# Altium project BLDC_DRIVER.PrjPcb
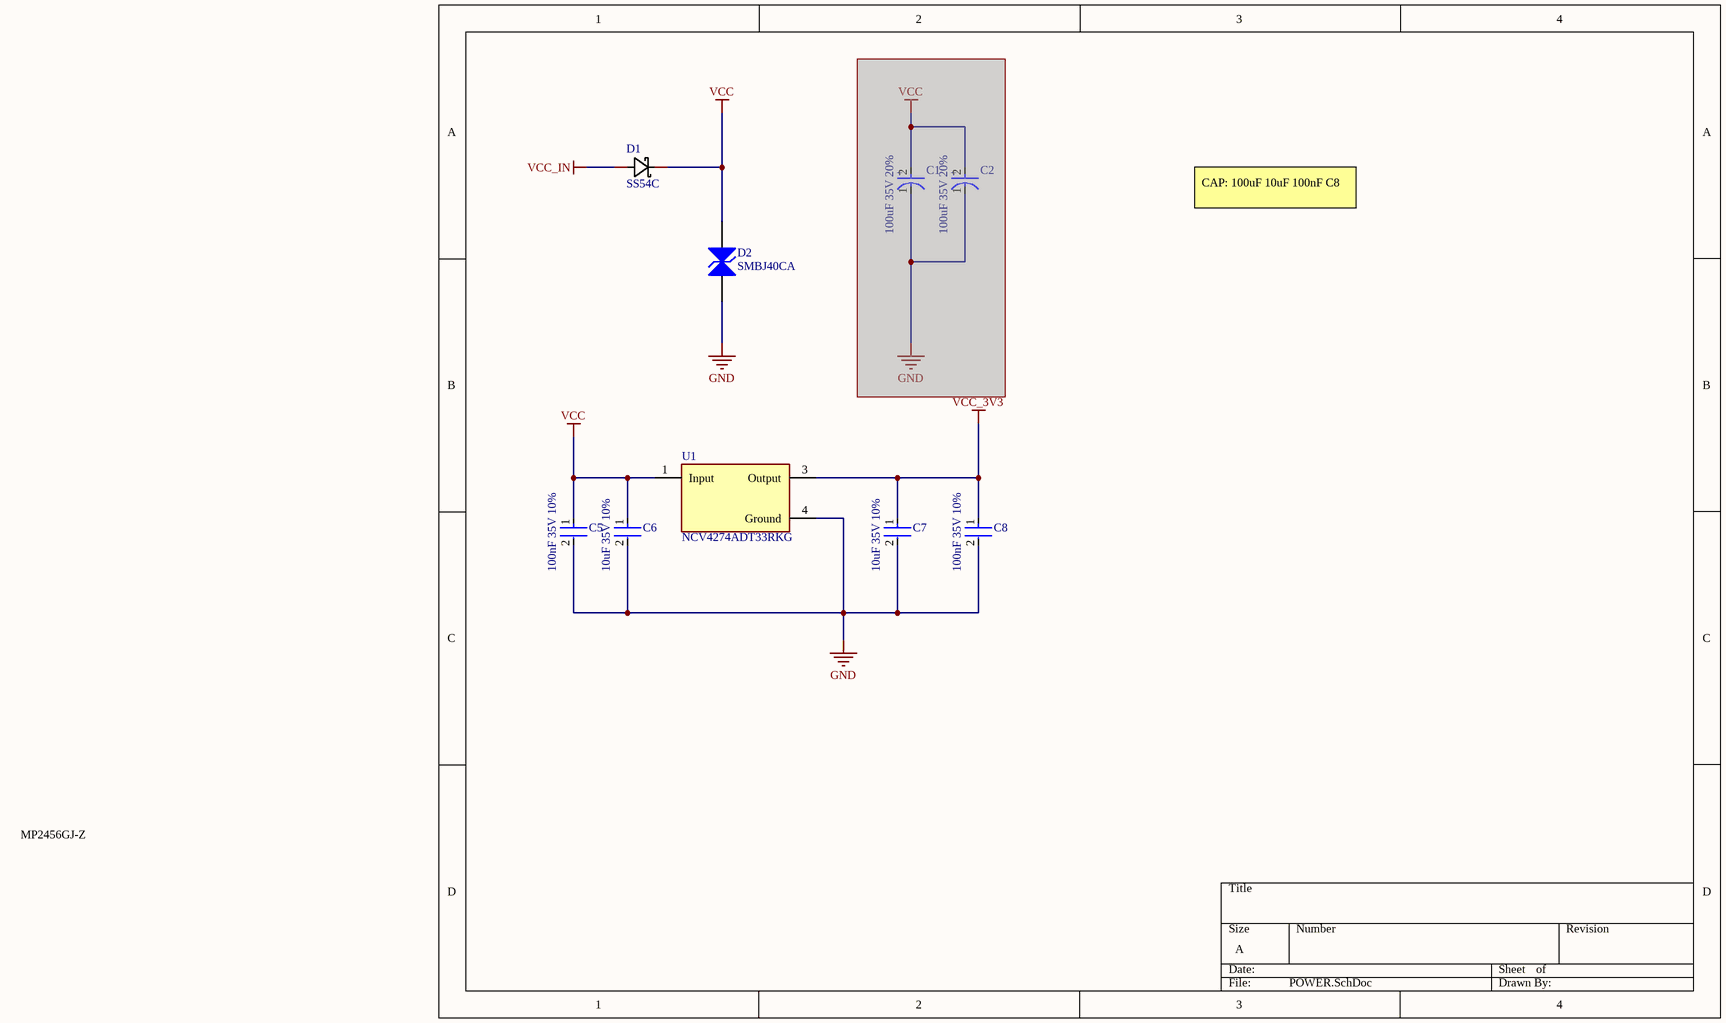
[diagram p0: POWER.SchDoc]
5 sheets, 66 parts. Net scope: global (net labels, ports and power ports of the same name join across sheets).
Board file: PCB.PcbDoc
Sheets:
  POWER.SchDoc
  MCU.SchDoc
  DRIVE.SchDoc
  SENSOR.SchDoc
  PORT.SchDoc

## Sheet POWER.SchDoc
size A; SheetNumber: 1; SheetTotal: 5; SPICEModelCachePBXSBNCE: <root> / <DocumentId>PBXSBNCE</DocumentId> / <CacheFrame Number="0"> / <Model Name="gmk105bj104_v-f" Kind="CKT"> / <Text>* GMK105BJ104_V-F     SPICE MODEL  ( General Type ) / *-------------------------------------------------------------------------------------------------------- / * Model Generated by TAIYO YUDEN Corporation (http://www.ty-top.com) / * Version 1.0 / * TAIYO YUDEN Control No. 170508_061226 / * Copyright(c) 2012 TAIYO YUDEN CO.,LTD. All Rights Reserved. / *-------------------------------------------------------------------------------------------------------- / * / * Products Name : Multilayer Ceramic Capacitors / * / * Characteristics : / *     Capacitance : 0.1 uF , Rated Voltage : 35V , TCC : B / X5R / *     Case Size : 1.0 x 0.5 / 0.039 x 0.02 [mm/inch] , Thickness : 0.5 / 0.02 [mm/inch] / *     (Conditions: Temperature = 25 degC , DC Bias Current/Voltage = 0A / 0V) / * / * Frequency Range : 40Hz - 3GHz / * / * External Node Assignments : / * / *  1  o---| |---o  2 / * / *-------------------------------------------------------------------------------------------------------- / .SubCkt GMK105BJ104_V-F 1 2 / **************************** / C0 1 110 0.070351u / Cm 1 101 0.016111u / C1 101 102 0.069296u / Rc1 101 102 16.146k / C2 102 103 0.030776u / Rc2 102 103 344.14 / C3 103 110 0.021195u / Rc3 103 110 5.1627 / C2m 1 301 0.020847u / C21 301 302 0.28927u / Rc21 301 302 15.286k / C22 302 303 0.26628u / Rc22 302 303 12.239k / C23 303 304 0.21132u / Rc23 303 304 15.145k / C24 304 305 0.078855u / Rc24 304 305 2.6688k / C25 305 306 0.20986u / Rc25 305 306 330.59 / C26 306 307 0.078155u / Rc26 306 307 723.11 / C27 307 308 0.029921u / Rc27 307 308 64.708 / C28 308 309 0.019548u / Rc28 308 309 24.402 / C29 309 110 1666p / Rc29 309 110 0.83666 / Rp0 1 110 5G / L0 110 120 0.25789n / Lm 120 130 0.093457n / L1 120 121 1.1632p / RL1 121 130 0.63209 / L2 120 122 2.3124p / RL2 122 130 1.1301 / L3 120 123 6.01p / RL3 123 130 4.6768 / CR 120 124 0.022616u / LR 124 125 0.050216n / RR 125 130 0.12272 / CL 130 140 1.7584p / LL 130 140 0.19044n / RL 130 140 98.661 / Rs 140 2 25.54m / **************************** / .ends GMK105BJ104_V-F</Text> / </Model> / <Model Name="gmk316ab7106_l-tr" Kind="CKT"> / <Text>* GMK316AB7106_L-TR     SPICE MODEL  ( General Type ) / *-------------------------------------------------------------------------------------------------------- / * Model Generated by TAIYO YUDEN Corporation (http://www.ty-top.com) / * Version 1.0 / * TAIYO YUDEN Control No. 170508_150223 / * Copyright(c) 2015 TAIYO YUDEN CO.,LTD. All Rights Reserved. / *-------------------------------------------------------------------------------------------------------- / * / * Products Name : Multilayer Ceramic Capacitors / * / * Characteristics : / *     Capacitance : 10 uF , Rated Voltage : 35V , TCC : X7R / *     Case Size : 3.2 x 1.6 / 0.126 x 0.063 [mm/inch] , Thickness : 1.6 / 0.063 [mm/inch] / *     (Conditions: Temperature = 25 degC , DC Bias Current/Voltage = 0A / 0V) / * / * Frequency Range : 40Hz - 3GHz / * / * External Node Assignments : / * / *  1  o---| |---o  2 / * / *-------------------------------------------------------------------------------------------------------- / .SubCkt GMK316AB7106_L-TR 1 2 / **************************** / C0 1 110 8.3324u / Cm 1 101 1.7802u / C1 101 102 3.8737u / Rc1 101 102 1.0428k / C2 102 103 2.6786u / Rc2 102 103 137.64 / C3 103 110 3.2592u / Rc3 103 110 0.72408 / C2m 1 301 1.3977u / C21 301 302 15.657u / Rc21 301 302 626.86 / C22 302 303 14.784u / Rc22 302 303 557.81 / C23 303 304 12.901u / Rc23 303 304 562.75 / C24 304 305 4.4911u / Rc24 304 305 239.54 / C25 305 306 2.8869u / Rc25 305 306 59.913 / C26 306 307 2.0034u / Rc26 306 307 27.629 / C27 307 308 2.0039u / Rc27 307 308 11.805 / C28 308 309 0.76536u / Rc28 308 309 18.018 / C29 309 110 0.087712u / Rc29 309 110 0.70541 / Rp0 1 110 10Meg / L0 110 120 0.29453n / Lm 120 130 0.27934n / L1 120 121 0.13982n / RL1 121 130 0.1458 / L2 120 122 0.50993n / RL2 122 130 0.17601 / L3 120 123 1.9812n / RL3 123 130 0.20956 / CR 120 124 1.0165u / LR 124 125 0.77549n / RR 125 130 30.723m / CL 130 140 1.2238p / LL 130 140 0.29705n / RL 130 140 42.338 / Rs 140 2 3.9735m / **************************** / .ends GMK316AB7106_L-TR</Text> / </Model> / </CacheFrame> / </root>

### Parts
C1  100uF 35V 20%  [FP-FTD-MFG]  (masked out: inside a compile mask, not in the netlist)
C2  100uF 35V 20%  [FP-FTD-MFG]  (masked out: inside a compile mask, not in the netlist)
C5  100nF 35V 10%  [FP-0402-L_1_0_0_05-W_0_5-IPC_A]
C6  10uF 35V 10%  [FP-1206-L_3_2_0_2-W_1_6_0-MFG]
C7  10uF 35V 10%  [FP-1206-L_3_2_0_2-W_1_6_0-MFG]
C8  100nF 35V 10%  [FP-0402-L_1_0_0_05-W_0_5-IPC_A]
D1  SS54C  [SMC_L6.9-W5.9-LS7.9-RD]
D2  SMBJ40CA  [FAIR-DO-214AA-A-2_V]
U1  NCV4274ADT33RKG  [FP-369C-MFG]

### Nets
GND: C5.2 C6.2 C7.2 C8.2 D2.2(A) U1.4(Ground)
VCC: C5.1 C6.1 D1.1(C) D2.1(A) U1.1(Input)  [project net VM11]
VCC_3V3: C7.1 C8.1 U1.3(Output)
VCC_IN: D1.2(A)

### Notes on the sheet
- CAP: 100uF 10uF 100nF C8
- MP2456GJ-Z
- (in symbol CMP-05427-000027-1) +

### Library data of the parts
C1 C2 = CMP-05427-000027-1: CAP ALUM 100UF 20% 35V SMD; Ripple Current: 300mA; Polarity: Polar; Life (Hours): 2000Hour; Lead Diameter: 0.65mm; ESR (Equivalent Series Resistance): 260mR; Leakage Current: 35uA; REACH SVHC: No SVHC; Series: FT; Min Operating Temperature: -55°C; Diameter: 6.3mm; Max Operating Temperature: 105°C; Number of Pins: 2; Package Quantity: 1000; Length: 5.8mm; Lead Pitch: 1.8mm; Voltage: 35V; Construction: Cylindrical; Capacitance: 100uF; Height: 5.8mm; Tolerance: 20%; RoHS Compliant: Yes; Packaging: Tape and Reel; Ripple Current (AC): 300mA; Height - Seated (Max): 0.24inch; Voltage Rating: 35V; Radiation Hardening: No; Contact Plating: Tin; Termination: SMD/SMT; Voltage Rating (DC): 35V; Case/Package: Radial; Mount: Surface Mount
C5 C8 = CMP-2000-06323-3: Dielectric: X5R; Voltage: 35V; Voltage Rating: 35V; Halogen Free: Halogen Free; Mount: Surface Mount; Max Operating Temperature: 85°C; Width: 0.02inch; Tolerance: 10%; Min Operating Temperature: -55°C; Length: 1mm; REACH SVHC: No SVHC; Voltage Rating (DC): 35V; Resistor Type: Ceramic; Radiation Hardening: No; Series: M; Termination: SMD/SMT; RoHS Compliant: Yes; Case/Package: 0402; Height: 0.5mm; Packaging: Tape and Reel; Construction: Flat; Capacitance: 100nF; Case Code (Metric): 1005; Case Code (Imperial): 0402; Depth: 0.5mm; Number of Pins: 2; Package Quantity: 1; Thickness: 0.022inch
C6 C7 = CMP-2000-06324-3: None; Dielectric: X7R; Thickness: 0.071inch; Mount: Surface Mount; Case Code (Imperial): 1206; Voltage Rating (DC): 35V; RoHS Compliant: Yes; Voltage Rating: 35V; Capacitance: 10uF; Case Code (Metric): 3216; Tolerance: 10%; Height: 1.6mm; Packaging: Tape and Reel; Resistor Type: Ceramic; REACH SVHC: No SVHC; Max Operating Temperature: 125°C; Termination: SMD/SMT; Package Quantity: 2000; Width: 1.6mm; Case/Package: 1206; Length: 0.126inch; Series: M; Min Operating Temperature: -55°C
D1 = SS54C_C880739: 二极管配置:-;直流反向耐压(Vr):40V;平均整流电流(Io):5A;正向压降(Vf):550mV@5A;反向电流(Ir):500A@40V;; Manufacturer: Slkor(萨科微); Add into BOM: yes; Reverse Voltage (Vr): 40V; Average Rectified Current (Io): 5A; Symbol: SS54C_C880739; Device: SS54C_C880739; LCSC Part Name: 40V 5A 550mV@5A; Supplier Part: C880739; Manufacturer Part: SS54C; Supplier Footprint: SMC(DO-214AB); JLCPCB Part Class: 扩展库; Datasheet: https://atta.szlcsc.com/upload/public/pdf/source/20201013/C880739_D47B31F19BD092A88A6CE51787FFA2A3.pdf; Supplier: LCSC; Convert to PCB: yes; Diode Configuration: -; Forward Voltage (Vf@If): 550mV@5A; Reverse Leakage Current (Ir): 500A@40V
D2 = CMP-2000-07097-1: Transient Voltage Suppressor, 600 W, 40 V, -55 to 150 degC, 2-Pin SMD, RoHS, Tape and Reel; Manufacturer: Fairchild Semiconductor; Breakdown Voltage-Max: 49.1V; Power Dissipation: 600W; Directional: Bi-Directional; Clamping Voltage-Max: 64.5V; Breakdown Voltage-Min: 44.4V; Datasheet URL: https://www.fairchildsemi.com/datasheets/SM/SMBJ40CA.pdf; Package Description: 2-Pin Surface Mount Device, Body 4.4 x 3.625 mm; Package Reference: DO-214AA; Manufacturer URL: https://www.fairchildsemi.com/; Mounting Technology: SurfaceMount; Datasheet Version: Rev. 1.1.1, 11/2014
U1 = CMP-07128-000011-1: IC REG LINEAR 3.3V 400MA DPAK; Manufacturer: ON SEMICONDUCTOR; Dropout Voltage: 1.27V; Automotive Grade: Grade 0; Number Of Outputs: 1; Max Supply Voltage: +45V; Accuracy Percentage: 2%; Standoff Height: 0mm; Max Junction Temp: +150°C; Min Supply Voltage: -42V; Output Type: Fixed; Nominal Supply Current: 145-30000uA; Digikey Description: IC REG LINEAR 3.3V 400MA DPAK; Manufacturer Part Number: NCV4274ADT33RKG; ComponentLink2Description: Datasheet; Lead Free: Yes; Output Current: 400mA; Temperature Range Low: -40°C; Temperature: -40°C to +150°C; Device Class L2: Power Management ICs; Category: IC; Device Class L1: Integrated Circuits (ICs); Octopart: https://octopart.com/ncv4274adt33rkg-on+semiconductor-10550992; Footprint Url: https://www.onsemi.com/pub/Collateral/369C.PDF; Automotive: Yes; Package: 369C; Mouser Description: IC REG LINEAR 3.3V 400MA DPAK-3; Device Class L3: Voltage Regulators - Linear; RoHS: TRUE; Height: 2.51mm; Output Voltage: 3.3V; Temperature Range High: +150°C; ComponentLink2URL: https://www.onsemi.com/pub/Collateral/NCV4274-D.PDF

## Sheet MCU.SchDoc
size A; SheetNumber: 2; SheetTotal: 5; SPICEModelCacheIKGZLCJW: <root> / <DocumentId>IKGZLCJW</DocumentId> / <CacheFrame Number="0"> / <Model Name="gmk105bj104_v-f" Kind="CKT"> / <Text>* GMK105BJ104_V-F     SPICE MODEL  ( General Type ) / *-------------------------------------------------------------------------------------------------------- / * Model Generated by TAIYO YUDEN Corporation (http://www.ty-top.com) / * Version 1.0 / * TAIYO YUDEN Control No. 170508_061226 / * Copyright(c) 2012 TAIYO YUDEN CO.,LTD. All Rights Reserved. / *-------------------------------------------------------------------------------------------------------- / * / * Products Name : Multilayer Ceramic Capacitors / * / * Characteristics : / *     Capacitance : 0.1 uF , Rated Voltage : 35V , TCC : B / X5R / *     Case Size : 1.0 x 0.5 / 0.039 x 0.02 [mm/inch] , Thickness : 0.5 / 0.02 [mm/inch] / *     (Conditions: Temperature = 25 degC , DC Bias Current/Voltage = 0A / 0V) / * / * Frequency Range : 40Hz - 3GHz / * / * External Node Assignments : / * / *  1  o---| |---o  2 / * / *-------------------------------------------------------------------------------------------------------- / .SubCkt GMK105BJ104_V-F 1 2 / **************************** / C0 1 110 0.070351u / Cm 1 101 0.016111u / C1 101 102 0.069296u / Rc1 101 102 16.146k / C2 102 103 0.030776u / Rc2 102 103 344.14 / C3 103 110 0.021195u / Rc3 103 110 5.1627 / C2m 1 301 0.020847u / C21 301 302 0.28927u / Rc21 301 302 15.286k / C22 302 303 0.26628u / Rc22 302 303 12.239k / C23 303 304 0.21132u / Rc23 303 304 15.145k / C24 304 305 0.078855u / Rc24 304 305 2.6688k / C25 305 306 0.20986u / Rc25 305 306 330.59 / C26 306 307 0.078155u / Rc26 306 307 723.11 / C27 307 308 0.029921u / Rc27 307 308 64.708 / C28 308 309 0.019548u / Rc28 308 309 24.402 / C29 309 110 1666p / Rc29 309 110 0.83666 / Rp0 1 110 5G / L0 110 120 0.25789n / Lm 120 130 0.093457n / L1 120 121 1.1632p / RL1 121 130 0.63209 / L2 120 122 2.3124p / RL2 122 130 1.1301 / L3 120 123 6.01p / RL3 123 130 4.6768 / CR 120 124 0.022616u / LR 124 125 0.050216n / RR 125 130 0.12272 / CL 130 140 1.7584p / LL 130 140 0.19044n / RL 130 140 98.661 / Rs 140 2 25.54m / **************************** / .ends GMK105BJ104_V-F</Text> / </Model> / </CacheFrame> / </root>
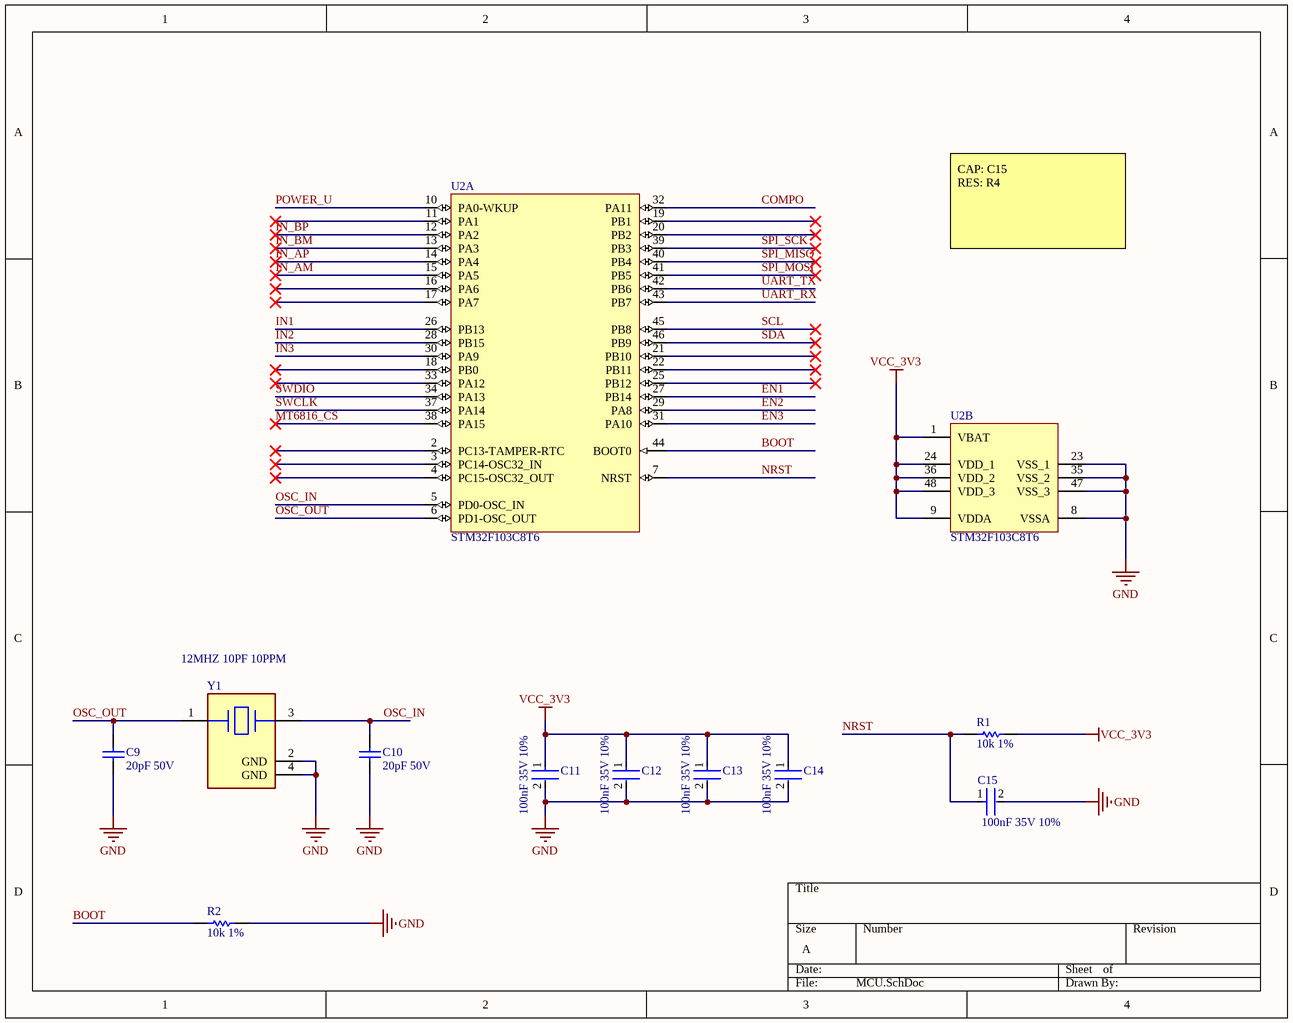
[diagram p1: MCU.SchDoc]

### Parts
(Parts that share a designator on the sheet are numbered #1, #2 ... from top to bottom, then left to right.)
C9  20pF 50V  [CAPC1608X90X30LL10T20]
C10  20pF 50V  [CAPC1608X90X30LL10T20]
C11  100nF 35V 10%  [FP-0402-L_1_0_0_05-W_0_5-IPC_A]
C12  100nF 35V 10%  [FP-0402-L_1_0_0_05-W_0_5-IPC_A]
C13  100nF 35V 10%  [FP-0402-L_1_0_0_05-W_0_5-IPC_A]
C14  100nF 35V 10%  [FP-0402-L_1_0_0_05-W_0_5-IPC_A]
C15  100nF 35V 10%  [FP-0402-L_1_0_0_05-W_0_5-IPC_A]
R1  10k 1%  [RESC2013X70X40ML20T20]
R2  10k 1%  [RESC2013X70X40ML20T20]
U2#1  STM32F103C8T6  [STM-LQFP48_L]  (parts A,B of 2)
Y1  12MHZ 10PF 10PPM  [FP-ABM3B-MFG]

### Nets
GND: C9.1 C10.1 C11.2 C12.2 C13.2 C14.2 C15.2 R2.2 U2#1.8(VSSA) U2#1.23(VSS_1) U2#1.35(VSS_2) U2#1.47(VSS_3) Y1.2(GND) Y1.4(GND)
VCC_3V3: C11.1 C12.1 C13.1 C14.1 R1.2 U2#1.1(VBAT) U2#1.9(VDDA) U2#1.24(VDD_1) U2#1.36(VDD_2) U2#1.48(VDD_3)
BOOT: R2.1 U2#1.44(BOOT0)
COMPO: U2#1.32(PA11)
EN1: U2#1.27(PB14)
EN2: U2#1.29(PA8)
EN3: U2#1.31(PA10)
IN1: U2#1.26(PB13)
IN2: U2#1.28(PB15)
IN3: U2#1.30(PA9)
IN_AM: U2#1.15(PA5)
IN_AP: U2#1.14(PA4)
IN_BM: U2#1.13(PA3)
IN_BP: U2#1.12(PA2)
MT6816_CS: U2#1.38(PA15)
NRST: C15.1 R1.1 U2#1.7(NRST)
OSC_IN: C10.2 U2#1.5(PD0-OSC_IN) Y1.3
OSC_OUT: C9.2 U2#1.6(PD1-OSC_OUT) Y1.1
POWER_U: U2#1.10(PA0-WKUP)
SCL: U2#1.45(PB8)
SDA: U2#1.46(PB9)
SPI_MISO: U2#1.40(PB4)
SPI_MOSI: U2#1.41(PB5)
SPI_SCK: U2#1.39(PB3)
SWCLK: U2#1.37(PA14)
SWDIO: U2#1.34(PA13)
UART_RX: U2#1.43(PB7)
UART_TX: U2#1.42(PB6)

Not connected (* = marked no-connect by the designer): U2#1 2(PC13-TAMPER-RTC)* 3(PC14-OSC32_IN)* 4(PC15-OSC32_OUT)* 11(PA1)* 16(PA6)* 17(PA7)* 18(PB0)* 19(PB1)* 20(PB2)* 21(PB10)* 22(PB11)* 25(PB12)* 33(PA12)*

### Notes on the sheet
- CAP: C15
  RES: R4

### Library data of the parts
C9 C10 = CMP-2000-06100-1: Chip Capacitor, 20 pF, +/- 5%, 50 V, -55 to 85 degC, 0603 (1608 Metric), RoHS, Tape and Reel; Manufacturer: Samsung Electro-Mechanics; Dielectric: C0G; Tolerance (%): ±5%; Case Size/Dimension: 0603; Datasheet Version: 06/2016; Rated Voltage: 50V; Manufacturer URL: http://www.samsungsem.com/global/index.jsp; Capacitance: 20pF; Datasheet URL: http://www.samsungsem.com/kr/support/product-search/mlcc/__icsFiles/afieldfile/2016/08/18/S_CL10C200JB8NNNC.pdf; Mounting Technology: SurfaceMount; Package Description: 2-Pin Surface Mount Device, Body 1.60 x 0.80 mm; Package Reference: 0603
C11-C15 = CMP-2000-06323-3: Dielectric: X5R; Voltage: 35V; Voltage Rating: 35V; Halogen Free: Halogen Free; Mount: Surface Mount; Max Operating Temperature: 85°C; Width: 0.02inch; Tolerance: 10%; Min Operating Temperature: -55°C; Length: 1mm; REACH SVHC: No SVHC; Voltage Rating (DC): 35V; Resistor Type: Ceramic; Radiation Hardening: No; Series: M; Termination: SMD/SMT; RoHS Compliant: Yes; Case/Package: 0402; Height: 0.5mm; Packaging: Tape and Reel; Construction: Flat; Capacitance: 100nF; Case Code (Metric): 1005; Case Code (Imperial): 0402; Depth: 0.5mm; Number of Pins: 2; Package Quantity: 1; Thickness: 0.022inch
R1 R2 = CMP-2001-04376-1: Manufacturer: Panasonic; Part Number: ERJ-6ENF1002V
U2#1 = CMP-0237-00215-3: ARM Cortex-M3 32-bit MCU, 64 KB Flash, 20 KB Internal RAM, 37 I/Os, 48-pin LQFP, -40 to 85 degC, Tray; Supply Voltage(Vcc) min (V): 2; Internal RAM Size (kB): 20; FLASH Size (Prog) (kB): 64; A/D Converter: 2x12-bit (10 Channel); I/Os (High Current): 37; Operating Frequency(F) (Processor speed) (MHz): 72; Core: ARM Cortex-M3; ComponentLink3Description: Package Specification; Mounting Technology: Surface Mount; PartNumber: STM32F103C8T6; PackageReference: LQFP48; Packing: Tray; ComponentLink3URL: http://www.st.com/st-web-ui/static/active/en/resource/technical/document/datasheet/DM00058181.pdf; DatasheetVersion: Rev. 16; ComponentLink1URL: http://www.st.com/web/en/home.html; PackageVersion: Rev. 6, 06/2013; ComponentLink2URL: http://www.st.com/st-web-ui/static/active/en/resource/technical/document/datasheet/CD00161566.pdf; ComponentLink1Description: Manufacturer URL; ComponentLink2Description: Datasheet; PackageDescription: 48-Pin Low Profile Quad Flat Package, 7 x 7 mm Body, 0.5 mm Pitch
Y1 = CMP-27762-011386-1: Crystal 12MHz ±10ppm 10pF SMD-4 5mm x 3.2mm; ESR (Equivalent Series Resistance): 70R; Resistor Type: Ceramic; Width: 0.126inch; Max Operating Temperature: 60°C; Series: ABM3B; Load Capacitance: 10pF; Package Quantity: 1000; Tolerance: 10ppm; Termination: SMD/SMT; Lead Free: Lead Free; Operating Frequency: 12 MHz; Number of Pins: 4; Case/Package: CSMD; Min Operating Temperature: -10°C; Packaging: Tape and Reel; Frequency Stability: 10ppm; Frequency: 12MHz; Height: 0.043inch; Depth: 3.2mm; Series Resistance: 70R; REACH SVHC: No SVHC; Length: 5mm; Mount: Surface Mount; Frequency Tolerance: 10ppm

## Sheet DRIVE.SchDoc
size 381 x 241 mm; SheetNumber: 3; SheetTotal: 5; SPICEModelCacheKBKWLXEO: <root> / <DocumentId>KBKWLXEO</DocumentId> / <CacheFrame Number="0"> / <Model Name="gmk105bj104_v-f" Kind="CKT"> / <Text>* GMK105BJ104_V-F     SPICE MODEL  ( General Type ) / *-------------------------------------------------------------------------------------------------------- / * Model Generated by TAIYO YUDEN Corporation (http://www.ty-top.com) / * Version 1.0 / * TAIYO YUDEN Control No. 170508_061226 / * Copyright(c) 2012 TAIYO YUDEN CO.,LTD. All Rights Reserved. / *-------------------------------------------------------------------------------------------------------- / * / * Products Name : Multilayer Ceramic Capacitors / * / * Characteristics : / *     Capacitance : 0.1 uF , Rated Voltage : 35V , TCC : B / X5R / *     Case Size : 1.0 x 0.5 / 0.039 x 0.02 [mm/inch] , Thickness : 0.5 / 0.02 [mm/inch] / *     (Conditions: Temperature = 25 degC , DC Bias Current/Voltage = 0A / 0V) / * / * Frequency Range : 40Hz - 3GHz / * / * External Node Assignments : / * / *  1  o---| |---o  2 / * / *-------------------------------------------------------------------------------------------------------- / .SubCkt GMK105BJ104_V-F 1 2 / **************************** / C0 1 110 0.070351u / Cm 1 101 0.016111u / C1 101 102 0.069296u / Rc1 101 102 16.146k / C2 102 103 0.030776u / Rc2 102 103 344.14 / C3 103 110 0.021195u / Rc3 103 110 5.1627 / C2m 1 301 0.020847u / C21 301 302 0.28927u / Rc21 301 302 15.286k / C22 302 303 0.26628u / Rc22 302 303 12.239k / C23 303 304 0.21132u / Rc23 303 304 15.145k / C24 304 305 0.078855u / Rc24 304 305 2.6688k / C25 305 306 0.20986u / Rc25 305 306 330.59 / C26 306 307 0.078155u / Rc26 306 307 723.11 / C27 307 308 0.029921u / Rc27 307 308 64.708 / C28 308 309 0.019548u / Rc28 308 309 24.402 / C29 309 110 1666p / Rc29 309 110 0.83666 / Rp0 1 110 5G / L0 110 120 0.25789n / Lm 120 130 0.093457n / L1 120 121 1.1632p / RL1 121 130 0.63209 / L2 120 122 2.3124p / RL2 122 130 1.1301 / L3 120 123 6.01p / RL3 123 130 4.6768 / CR 120 124 0.022616u / LR 124 125 0.050216n / RR 125 130 0.12272 / CL 130 140 1.7584p / LL 130 140 0.19044n / RL 130 140 98.661 / Rs 140 2 25.54m / **************************** / .ends GMK105BJ104_V-F</Text> / </Model> / </CacheFrame> / </root>
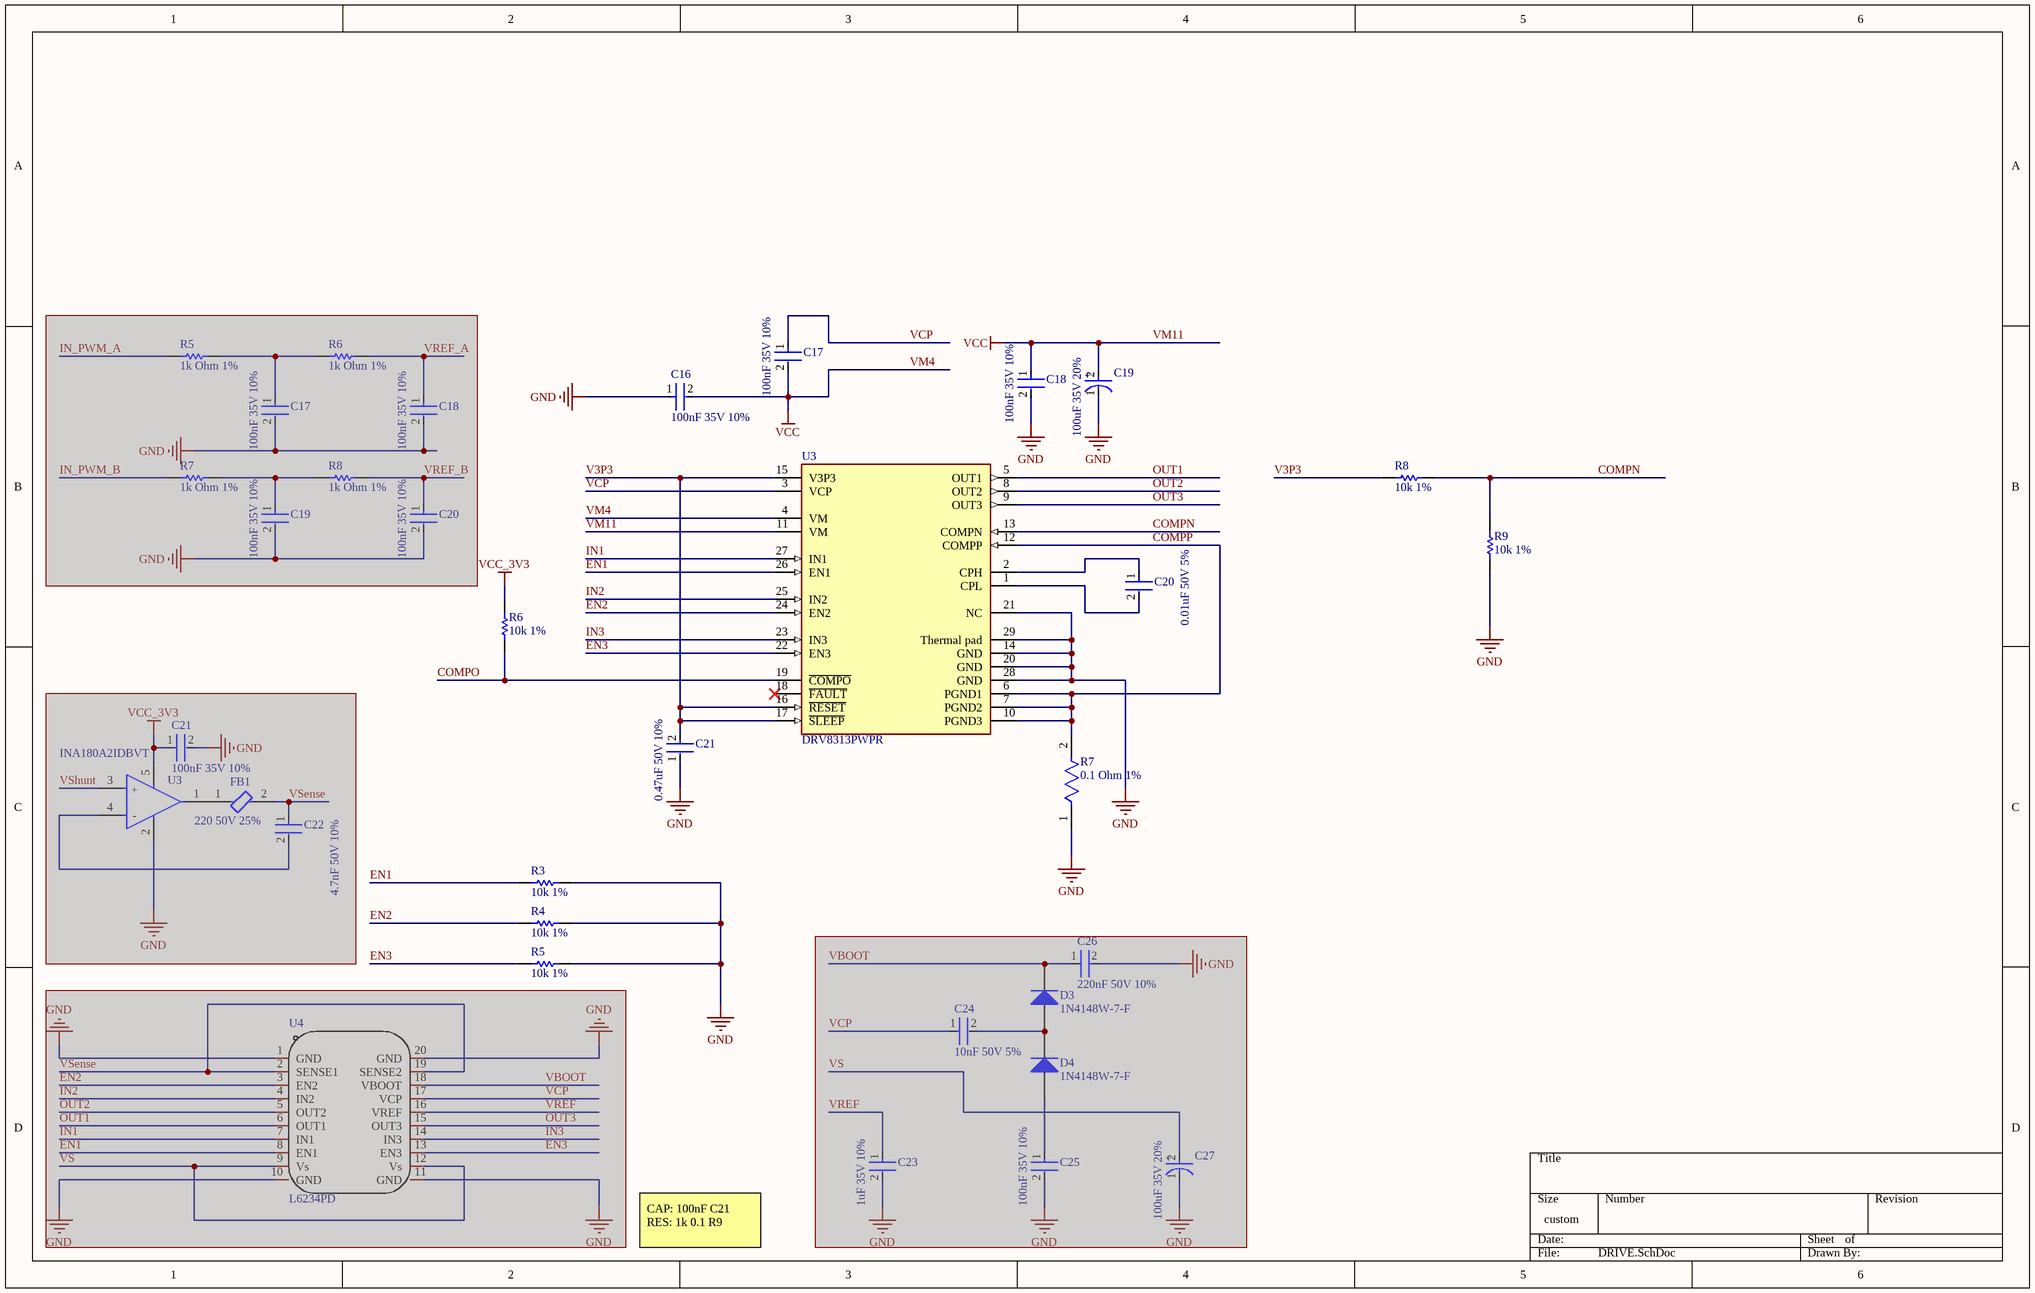
[diagram p2: DRIVE.SchDoc]

### Parts
(Parts that share a designator on the sheet are numbered #1, #2 ... from top to bottom, then left to right.)
C16  100nF 35V 10%  [FP-0402-L_1_0_0_05-W_0_5-IPC_A]
C17#1  100nF 35V 10%  [FP-0402-L_1_0_0_05-W_0_5-IPC_A]
C17#2  100nF 35V 10%  [FP-0402-L_1_0_0_05-W_0_5-IPC_A]  (masked out: inside a compile mask, not in the netlist)
C18#1  100nF 35V 10%  [FP-0402-L_1_0_0_05-W_0_5-IPC_A]
C18#2  100nF 35V 10%  [FP-0402-L_1_0_0_05-W_0_5-IPC_A]  (masked out: inside a compile mask, not in the netlist)
C19#1  100uF 35V 20%  [FP-FTD-MFG]
C19#2  100nF 35V 10%  [FP-0402-L_1_0_0_05-W_0_5-IPC_A]  (masked out: inside a compile mask, not in the netlist)
C20#1  100nF 35V 10%  [FP-0402-L_1_0_0_05-W_0_5-IPC_A]  (masked out: inside a compile mask, not in the netlist)
C20#2  0.01uF 50V 5%  [FP-C0805C-DN-MFG]
C21#1  0.47uF 50V 10%  [FP-C1608-080-0_1-IPC_A]
C21#2  100nF 35V 10%  [FP-0402-L_1_0_0_05-W_0_5-IPC_A]  (masked out: inside a compile mask, not in the netlist)
C22#1  4.7nF 50V 10%  [FP-1206-L_3_2_0_2-W_1_6_0-IPC_C]  (masked out: inside a compile mask, not in the netlist)
C23#1  1uF 35V 10%  [FP-0805-L_2_0_0_1-W_1_25-IPC_C]  (masked out: inside a compile mask, not in the netlist)
C24#1  10nF 50V 5%  [FP-GRM219-0_1-IPC_C]  (masked out: inside a compile mask, not in the netlist)
C25  100nF 35V 10%  [FP-0402-L_1_0_0_05-W_0_5-IPC_A]  (masked out: inside a compile mask, not in the netlist)
C26  220nF 50V 10%  [FP-C1608-080-0_1-IPC_C]  (masked out: inside a compile mask, not in the netlist)
C27  100uF 35V 20%  [FP-FTD-MFG]  (masked out: inside a compile mask, not in the netlist)
D3  1N4148W-7-F  [DIOD-SOD123-2_V]  (masked out: inside a compile mask, not in the netlist)
D4  1N4148W-7-F  [DIOD-SOD123-2_V]  (masked out: inside a compile mask, not in the netlist)
FB1  220 50V 25%  [FP-BLM18-0_15-t0_5-IPC_A]  (masked out: inside a compile mask, not in the netlist)
R3  10k 1%  [RESC2013X70X40ML20T20]
R4  10k 1%  [RESC2013X70X40ML20T20]
R5#1  1k Ohm 1%  [RESC2013X60X35ML10T20]  (masked out: inside a compile mask, not in the netlist)
R5#2  10k 1%  [RESC2013X70X40ML20T20]
R6#1  1k Ohm 1%  [RESC2013X60X35ML10T20]  (masked out: inside a compile mask, not in the netlist)
R6#2  10k 1%  [RESC2013X70X40ML20T20]
R7#1  1k Ohm 1%  [RESC2013X60X35ML10T20]  (masked out: inside a compile mask, not in the netlist)
R7#2  0.1 Ohm 1%  [FP-ERJ8BW-MFG]
R8#1  10k 1%  [RESC2013X70X40ML20T20]
R8#2  1k Ohm 1%  [RESC2013X60X35ML10T20]  (masked out: inside a compile mask, not in the netlist)
R9  10k 1%  [RESC2013X70X40ML20T20]
U3#1  DRV8313PWPR  [FP-PWP0028C-IPC_B]
U3#2  INA180A2IDBVT  [FP-DBV0005A-IPC_C]  (masked out: inside a compile mask, not in the netlist)
U4#1  L6234PD  [POWERSO-20_L15.9-W11.0-P1.27-LS14.2-BL-EP]  (masked out: inside a compile mask, not in the netlist)

### Nets
GND: C16.1 C18#1.2 C19#1.1(C) C21#1.1 R3.2 R4.2 R5#2.2 R7#2.1 R9.1 U3#1.14(GND) U3#1.20(GND) U3#1.21(NC) U3#1.28(GND) U3#1.29(Thermal_pad)
VCC_3V3: R6#2.2
VM11: C16.2 C17#1.2 C18#1.1 C19#1.2(A) U3#1.4(VM) U3#1.11(VM)  [also labelled VCC, VM4]
COMPN: R8#1.2 R9.2 U3#1.13(COMPN)
COMPO: R6#2.1 U3#1.19(~{COMPO})
COMPP: R7#2.2 U3#1.6(PGND1) U3#1.7(PGND2) U3#1.10(PGND3) U3#1.12(COMPP)
EN1: R3.1 U3#1.26(EN1)
EN2: R4.1 U3#1.24(EN2)
EN3: R5#2.1 U3#1.22(EN3)
IN1: U3#1.27(IN1)
IN2: U3#1.25(IN2)
IN3: U3#1.23(IN3)
OUT1: U3#1.5(OUT1)
OUT2: U3#1.8(OUT2)
OUT3: U3#1.9(OUT3)
V3P3: C21#1.2 R8#1.1 U3#1.15(V3P3) U3#1.16(~{RESET}) U3#1.17(~{SLEEP})
VCP: C17#1.1 U3#1.3(VCP)
NetC20#2_1: C20#2.1 U3#1.2(CPH)
NetC20#2_2: C20#2.2 U3#1.1(CPL)

Not connected (* = marked no-connect by the designer): U3#1 18(~{FAULT})*

### Notes on the sheet
- CAP: 100nF C21
  RES: 1k 0.1 R9
- (in symbol CMP-04895-000174-1) +; -
- (in symbol CMP-05427-000027-1) +

### Library data of the parts
C16 C17#1 C17#2 C18#1 C18#2 C19#2 C20#1 C21#2 C25 = CMP-2000-06323-3: Dielectric: X5R; Voltage: 35V; Voltage Rating: 35V; Halogen Free: Halogen Free; Mount: Surface Mount; Max Operating Temperature: 85°C; Width: 0.02inch; Tolerance: 10%; Min Operating Temperature: -55°C; Length: 1mm; REACH SVHC: No SVHC; Voltage Rating (DC): 35V; Resistor Type: Ceramic; Radiation Hardening: No; Series: M; Termination: SMD/SMT; RoHS Compliant: Yes; Case/Package: 0402; Height: 0.5mm; Packaging: Tape and Reel; Construction: Flat; Capacitance: 100nF; Case Code (Metric): 1005; Case Code (Imperial): 0402; Depth: 0.5mm; Number of Pins: 2; Package Quantity: 1; Thickness: 0.022inch
C19#1 C27 = CMP-05427-000027-1: as C1 on sheet POWER; REACH SVHC: No SVHC; Series: FT; Min Operating Temperature: -55°C; Diameter: 6.3mm; Max Operating Temperature: 105°C; Number of Pins: 2; Package Quantity: 1000; Length: 5.8mm; Lead Pitch: 1.8mm; Voltage: 35V; Construction: Cylindrical; Capacitance: 100uF; Height: 5.8mm; Tolerance: 20%; RoHS Compliant: Yes; Packaging: Tape and Reel; Ripple Current (AC): 300mA; Height - Seated (Max): 0.24inch; Voltage Rating: 35V; Radiation Hardening: No; Contact Plating: Tin; Termination: SMD/SMT; Voltage Rating (DC): 35V; Case/Package: Radial; Mount: Surface Mount
C20#2 = CMP-2007-00254-2: CAP CER 10000PF 50V X7R 0805; Manufacturer Part Number: C0805C103J5RACTU; Manufacturer: KEMET; Value: 10,000 pF; Material: Ceramic; Temperature Coefficient: 30ppm/°C; Description: C0805 10,000 pF X7R 30ppm/°C 5.00% 50 V; Tolerance: 0.05; Device Class L1: Passive Components; Temperature: -55°C to +125°C; Lead Free: Yes; ComponentLink2URL: https://content.kemet.com/datasheets/KEM_C1003_C0G_SMD.pdf; Device Class L3: Ceramic Capacitors; Temperature Characteristic: X7R; Temperature Range High: +125°C; Mouser Description: Capacitor; Ceramic; Cap 0.01uF; Tol 5%; Vol-Rtg 50 V; SMT; Case 0805; X7R; TR; ComponentLink2Description: Datasheet; Height: 0.88mm; Digikey Description: CAP CER 10000PF 50V X7R 0805; Capacitance: 10,000 pF; Temperature Range Low: -55°C; Device Class L2: Capacitors; Octopart: https://octopart.com/c0805c103j5ractu-kemet-133473; Voltage Rating: 50 V; Category: Cap; RoHS: TRUE; Automotive: No; Package: C0805C-DN; Ipc Land Pattern Name: CAPC200125X78
C21#1 = CMP-08246-003628-1: Multilayer Ceramic Capacitors 470nF ±10% 50V X7R SMD 0603; Resistor Type: Ceramic; Radiation Hardening: No; Termination: SMD/SMT; Min Operating Temperature: -55°C; RoHS Compliant: Yes; Length: 1.6mm; Package Quantity: 4000; Tolerance: 10%; Packaging: Cut Tape; Max Operating Temperature: 125°C; Series: C; Thickness: 0.037inch; Voltage Rating (DC): 50V; Mount: Surface Mount; Weight: 7.1E-05oz; Dielectric: X7R; Case/Package: 0603; Construction: Flat; Height: 0.8mm; Capacitance: 470nF; Case Code (Metric): 1608; Voltage: 50V; Dielectric Material: Ceramic; Voltage Rating: 50V; Depth: 0.8mm; Lead Free: Lead Free; REACH SVHC: No SVHC; Width: 0.031inch; Case Code (Imperial): 0603
C22#1 = CMP-04427-019159-1: General Purpose Ceramic Capacitor, 1206, 4.7nF, 10%, X7R, 15%, 50V; Dissipation Factor: 2.5%; Min Operating Temperature: -55°C; Length: 3.2mm; Mount: Surface Mount; Case Code (Metric): 3216; Depth: 1.6mm; Voltage Rating (DC): 50V; Dielectric Material: Ceramic; Termination: SMD/SMT; Radiation Hardening: No; Voltage: 50V; Capacitance: 4.7nF; Dielectric: X7R; Series: -; Max Operating Temperature: 125°C; Lead Free: Lead Free; Number of Pins: 2; Tolerance: 10%; Thickness: 0.037inch; Packaging: Tape and Reel; Package Quantity: 1; Case/Package: 1206; Contact Plating: Tin; Construction: Flat; Height: 0.94mm; Voltage Rating: 50V; RoHS Compliant: Yes; Width: 1.6mm; Case Code (Imperial): 1206
C23#1 = CMP-14477-004038-2: Multilayer Ceramic Capacitor 1 uF 35V X7R 10% SMD 0805 T/R; Contact Plating: Nickel; Voltage: 35V; Height: 1.25mm; Width: 0.049inch; Voltage Rating: 35V; Depth: 1.25mm; Capacitance: 1uF; Packaging: Tape and Reel; Radiation Hardening: No; Min Operating Temperature: -55°C; Series: M; Halogen Free: Halogen Free; Thickness: 0.053inch; Termination: SMD/SMT; Length: 2mm; Lead Free: Lead Free; Case/Package: 0805; Construction: Flat; RoHS Compliant: Yes; Tolerance: 10%; Package Quantity: 1; Max Operating Temperature: 125°C; Number of Pins: 2; Voltage Rating (DC): 35V; Case Code (Imperial): 0805; Case Code (Metric): 2012; Dielectric: X7R; Mount: Surface Mount
C24#1 = CMP-2007-00135-2: Chip Multilayer Ceramic Capacitors for General Purpose, 0805, 10000pF, C0G, 30ppm/°C, 5%, 50V; Insulation Resistance: 10GR; Max Operating Temperature: 125°C; Height: 0.85mm; Voltage: 50V; Dielectric Material: Ceramic; Voltage Rating: 50V; Dielectric: C0G; Thickness: 0.037inch; REACH SVHC: No SVHC; Lead Free: Lead Free; Depth: 1.25mm; Min Operating Temperature: -55°C; Package Quantity: 1; Packaging: Tape and Reel; Case Code (Imperial): 0805; Case/Package: 0805; Mount: Surface Mount; Width: 0.049inch; Case Code (Metric): 2012; Length: 2mm; Termination: SMD/SMT; Material: Ceramic; Tolerance: 5%; Temperature Coefficient: 30ppm/°C; Capacitance: 10nF; Number of Pins: 2; Voltage Rating (DC): 50V; Radiation Hardening: No
C26 = CMP-2000-05394-2: Multilayer Ceramic Capacitors 220nF ±10% 50V X7R SMD 0603; Construction: Flat; Case Code (Imperial): 0603; Min Operating Temperature: -55°C; Weight: 7.1E-05oz; Dielectric: X7R; Radiation Hardening: No; Length: 1.6mm; Mount: Surface Mount; Tolerance: 10%; Thickness: 0.035inch; Capacitance: 220nF; Dielectric Material: Ceramic; Voltage: 50V; Depth: 0.8mm; Voltage Rating (DC): 50V; REACH SVHC: No SVHC; RoHS Compliant: Yes; Lead Free: Lead Free; Termination: SMD/SMT; Max Operating Temperature: 125°C; Packaging: Tape and Reel; Voltage Rating: 50V; Series: C; Case/Package: 0603; Resistor Type: Ceramic; Package Quantity: 1; Number of Pins: 2; Height: 0.8mm; Case Code (Metric): 1608; Width: 0.031inch
D3 D4 = CMP-2000-04932-2: Fast Switching Diode, 100 V, 0.15 A, -65 to 150 degC, 2-Pin?SOD123, RoHS, Tape and Reel; Recovery Time: 4ns; Brand: DiodesIncorporated; Unit Weight: 0.000353oz; Max Surge Current: 2A; Peak Reverse Voltage: 100V; Ir - Reverse Current: 1uA; Vf - Forward Voltage: 1.25V; Configuration: Single; If - Forward Current: 0.15A; Product Category: Diodes-GeneralPurpose,Power,Switching; Operating Temperature Range: -65Cto+150C; Packaging: Reel; Manufacturer URL: http://www.diodes.com/; Maximum Operating Temperature: +150C; Height: 1.25mm; Minimum Operating Temperature: -65C; Product: SwitchingDiodes; Package URL: http://www.diodes.com/datasheets/ds18004.pdf; Type: SwitchingDiode; Package Reference: SOD123-2; Width: 1.7mm; Datasheet URL: http://www.farnell.com/datasheets/1915529.pdf; Datasheet Version: Rev. 24-2, 10/2013; Series: 1N4148; Factory Pack Quantity: 3000; Length: 2.85mm; RoHS: True; Manufacturer: DiodesIncorporated; Mounting Style: SMD/SMT; Package / Case: SOD-123
FB1 = CMP-0686-00596-3: Chip Ferrite Bead, 0603, 220Ω @ 100MHz, 25%, 0.04Ω, 2.5A; Impedance: 220R; DC Resistance-Max: 40mR; Number of Circuits: 1; Test Frequency: 100MHz; Material: Ferrite; Lead Free: Lead Free; Width: 0.8mm; Max Current Rating: 2.5A; Termination: SMD/SMT; Depth: 0.95mm; Packaging: Tape and Reel; Case Code (Metric): 1608; DC Current: 2.5A; Weight: 7.1E-05oz; Min Operating Temperature: -55°C; DC Resistance (DCR): 40mR; Max Operating Temperature: 125°C; Core Material: Ferrite; Max DC Current: 2.5A; Case/Package: 0603; REACH SVHC: No SVHC; Height: 0.8mm; Number of Pins: 2; Tolerance: 25%; RoHS Compliant: Yes; Radiation Hardening: No; Current Rating: 2.5A; Number of Lines: 1; Series: BLM18S; Case Code (Imperial): 0603; Length: 1.6mm; Package Quantity: 1
R3 R4 R5#2 R6#2 R8#1 R9 = CMP-2001-04376-1: as R1 on sheet MCU
R5#1 R6#1 R7#1 R8#2 = CMP-2100-03671-1: Chip Resistor, 1 KOhm, +/- 1%, 125 mW, -55 to 155 degC, 0805 (2012 Metric), RoHS, Tape and Reel; Manufacturer: Yageo; Temperature Coefficient: 100ppm/degreesC; Voltage Rating (DC): 150V; Max Power Dissipation: 125mW; Resistance: 1KOhm; Number of Pins: 2; Number of Terminations: 2; Datasheet URL: http://www.yageo.com/NewPortal/yageodocoutput?fileName=/pdf/R-Chip/PYu-RC_Group_51_RoHS_L_5.pdf; Length: 0.079inch; Package Description: 2-Pin Surface Mounted Device, Body 2 x 1.25 mm; Depth: 1.25mm; Height: 0.024inch; Military Standard: Not; Case/Package: 0805; Package Reference: 0805; RoHSCompliant: true; Lead Free: LeadFree; Packaging: TapeandReel; Package Quantity: 1; Datasheet Version: Rev. 5, 10/2016; Tolerance: 1%; Min Operating Temperature: -55degC; Voltage Rating: 150V; Composition: ThickFilm; Case Code (Imperial): 0805; Power Rating: 125mW; Width: 0.049inch; Case Code (Metric): 2012; Manufacturer URL: http://www.yageo.com/; Max Operating Temperature: 155degC; REACH SVHC: Unknown; Termination: SMD/SMT
R7#2 = CMP-2003-00785-2: RES 0.1 OHM 1% 1W 1206; Resistance: 100mR; Temperature Coefficient: 100ppm/°C; Lead Free: Lead Free; Features: Automotive AEC-Q200; Case/Package: 1206; Width: 0.063inch; Radiation Hardening: No; Power Rating: 1W; Resistance Tolerance: 1%; Resistor Type: Thick Film; Max Power Dissipation: 1W; Case Code (Metric): 3216; Package Quantity: 1; Tolerance: 1%; Number of Terminations: 2; Number of Pins: 2; Length: 3.2mm; Case Code (Imperial): 1206; Size Code: 1206; Mount: Surface Mount; Height: 0.65mm; Termination: SMD/SMT; Min Operating Temperature: -55°C; Packaging: Tape and Reel; Military Standard: Not; Series: ERJ; Depth: 1.6mm; REACH SVHC: No SVHC; Max Operating Temperature: 155°C; Contact Plating: Tin; Technology: THICK FILM; RoHS Compliant: Yes; Construction: Rectangular
U3#1 = CMP-04915-000025-1: IC MOTOR DRIVER 8V-60V 28HTSSOP; Min Supply Voltage: 8V; Max Supply Voltage: 60V; Interface: Parallel; Output Current: 1.75A; Number of Outputs: 1; Logic Function: AND GATE; Package Quantity: 2000; Number of Pins: 28; Case/Package: HTSSOP; Min Operating Temperature: -40°C; Mount: Surface Mount; Series: -; Packaging: Tape and Reel; Max Operating Temperature: 125°C; Lead Free: Lead Free
U3#2 = CMP-04895-000174-1: IC CURR SENSE 1 CIRCUIT SOT23-5; Number of Circuits: 1; Input Offset Voltage (Vos): 100uV; Operating Supply Current: 260uA; -3db Bandwidth: 350kHz; Slew Rate: 2V/µs; Input Bias Current: 100nA; Min Operating Temperature: -40°C; Mount: Surface Mount; RoHS Compliant: Yes; Packaging: Tape and Reel; Case/Package: SOT-23-5; Max Operating Temperature: 125°C
U4#1 = L6234PD: Manufacturer: ST(意法半导体); Add into BOM: yes; Symbol: L6234PD; Device: L6234PD; LCSC Part Name: L6234PD; Supplier Part: C1523896; Manufacturer Part: L6234PD; Supplier Footprint: PowerSO-20; JLCPCB Part Class: 扩展库; Datasheet: https://atta.szlcsc.com/upload/public/pdf/source/20210630/7ACC9A8B265CB70C9962226C06E1BA42.pdf; Supplier: LCSC; Convert to PCB: yes

## Sheet SENSOR.SchDoc
size A4; SheetNumber: 4; SheetTotal: 5; SPICEModelCacheALUSSDSW: <root> / <DocumentId>ALUSSDSW</DocumentId> / <CacheFrame Number="0"> / <Model Name="gmk105bj104_v-f" Kind="CKT"> / <Text>* GMK105BJ104_V-F     SPICE MODEL  ( General Type ) / *-------------------------------------------------------------------------------------------------------- / * Model Generated by TAIYO YUDEN Corporation (http://www.ty-top.com) / * Version 1.0 / * TAIYO YUDEN Control No. 170508_061226 / * Copyright(c) 2012 TAIYO YUDEN CO.,LTD. All Rights Reserved. / *-------------------------------------------------------------------------------------------------------- / * / * Products Name : Multilayer Ceramic Capacitors / * / * Characteristics : / *     Capacitance : 0.1 uF , Rated Voltage : 35V , TCC : B / X5R / *     Case Size : 1.0 x 0.5 / 0.039 x 0.02 [mm/inch] , Thickness : 0.5 / 0.02 [mm/inch] / *     (Conditions: Temperature = 25 degC , DC Bias Current/Voltage = 0A / 0V) / * / * Frequency Range : 40Hz - 3GHz / * / * External Node Assignments : / * / *  1  o---| |---o  2 / * / *-------------------------------------------------------------------------------------------------------- / .SubCkt GMK105BJ104_V-F 1 2 / **************************** / C0 1 110 0.070351u / Cm 1 101 0.016111u / C1 101 102 0.069296u / Rc1 101 102 16.146k / C2 102 103 0.030776u / Rc2 102 103 344.14 / C3 103 110 0.021195u / Rc3 103 110 5.1627 / C2m 1 301 0.020847u / C21 301 302 0.28927u / Rc21 301 302 15.286k / C22 302 303 0.26628u / Rc22 302 303 12.239k / C23 303 304 0.21132u / Rc23 303 304 15.145k / C24 304 305 0.078855u / Rc24 304 305 2.6688k / C25 305 306 0.20986u / Rc25 305 306 330.59 / C26 306 307 0.078155u / Rc26 306 307 723.11 / C27 307 308 0.029921u / Rc27 307 308 64.708 / C28 308 309 0.019548u / Rc28 308 309 24.402 / C29 309 110 1666p / Rc29 309 110 0.83666 / Rp0 1 110 5G / L0 110 120 0.25789n / Lm 120 130 0.093457n / L1 120 121 1.1632p / RL1 121 130 0.63209 / L2 120 122 2.3124p / RL2 122 130 1.1301 / L3 120 123 6.01p / RL3 123 130 4.6768 / CR 120 124 0.022616u / LR 124 125 0.050216n / RR 125 130 0.12272 / CL 130 140 1.7584p / LL 130 140 0.19044n / RL 130 140 98.661 / Rs 140 2 25.54m / **************************** / .ends GMK105BJ104_V-F</Text> / </Model> / </CacheFrame> / </root>
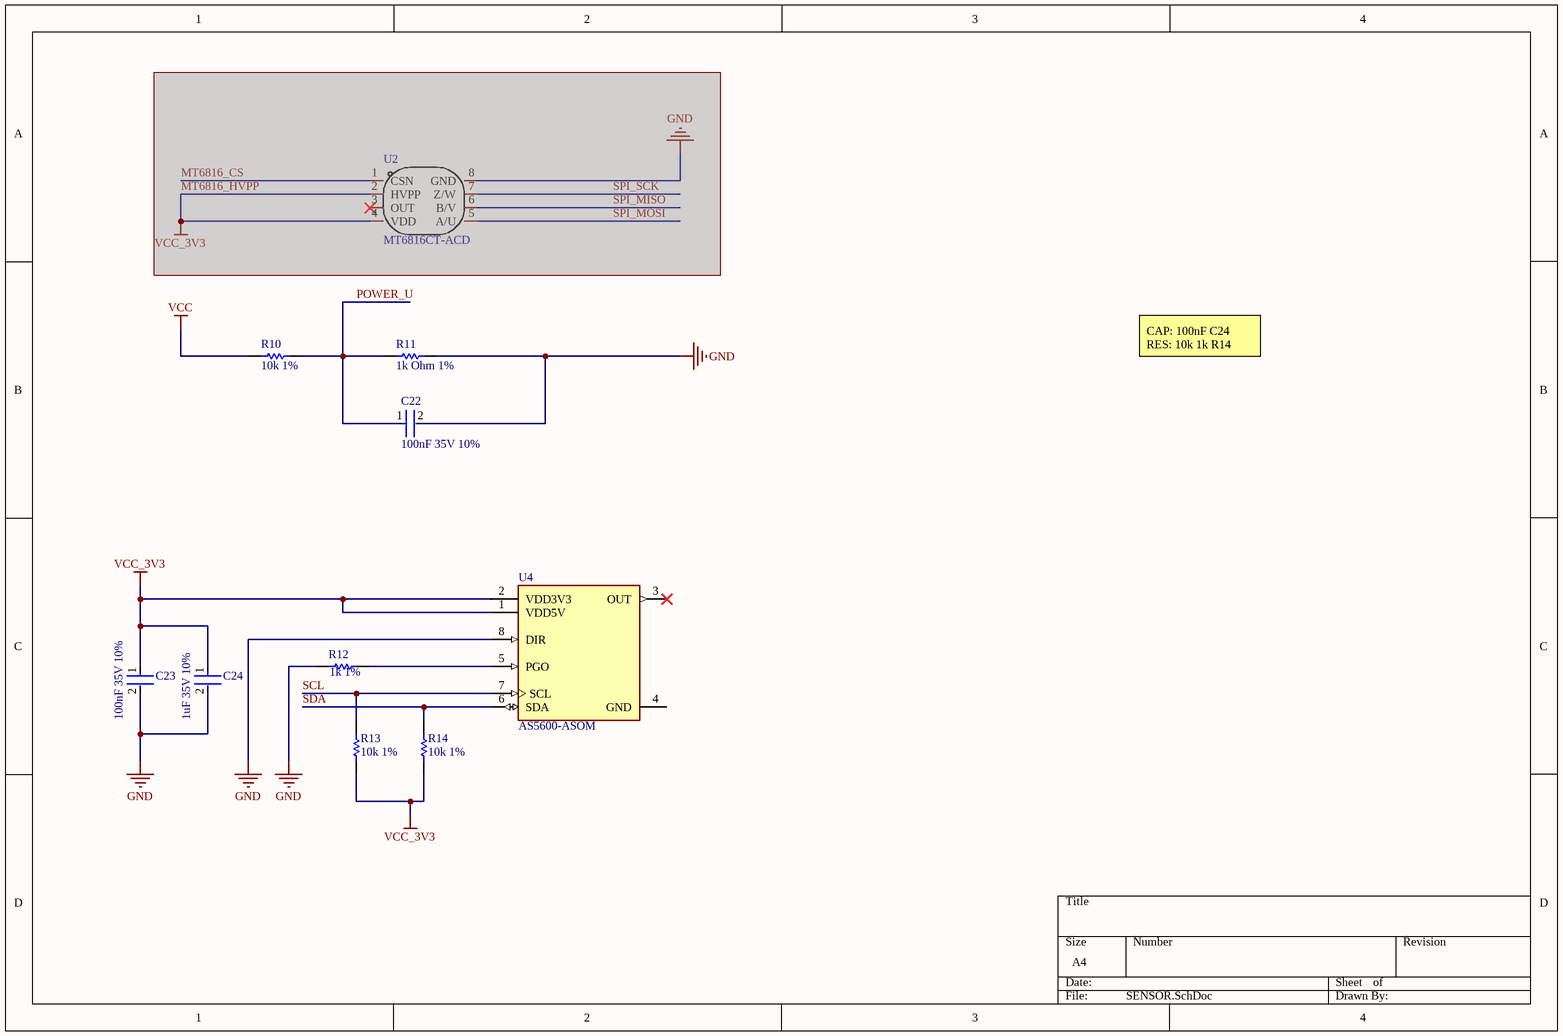
[diagram p3: SENSOR.SchDoc]

### Parts
(Parts that share a designator on the sheet are numbered #1, #2 ... from top to bottom, then left to right.)
C22#2  100nF 35V 10%  [FP-0402-L_1_0_0_05-W_0_5-IPC_A]
C23#2  100nF 35V 10%  [FP-0402-L_1_0_0_05-W_0_5-IPC_A]
C24#2  1uF 35V 10%  [FP-0805-L_2_0_0_1-W_1_25-IPC_C]
R10  10k 1%  [RESC2013X70X40ML20T20]
R11  1k Ohm 1%  [RESC2013X60X35ML10T20]
R12  1k 1%  [RESC3216X70X50LL05T20]
R13  10k 1%  [RESC2013X70X40ML20T20]
R14  10k 1%  [RESC2013X70X40ML20T20]
U2#2  MT6816CT-ACD  [SOP-8_L5.0-W4.0-P1.27-LS6.0-BL]  (masked out: inside a compile mask, not in the netlist)
U4#2  AS5600-ASOM  [FP-AS5600-ASOM-IPC_C]

### Nets
GND: C22#2.2 C23#2.2 C24#2.2 R11.2 R12.1 U4#2.8(DIR)
VCC: R10.2  [project net VM11]
VCC_3V3: C23#2.1 C24#2.1 R13.1 R14.1 U4#2.1(VDD5V) U4#2.2(VDD3V3)
POWER_U: C22#2.1 R10.1 R11.1
SCL: R13.2 U4#2.7(SCL)
SDA: R14.2 U4#2.6(SDA)
NetR12_2: R12.2 U4#2.5(PGO)

Not connected (* = marked no-connect by the designer): U4#2 3(OUT)* 4(GND)

### Notes on the sheet
- CAP: 100nF C24
  RES: 10k 1k R14

### Library data of the parts
C22#2 C23#2 = CMP-2000-06323-3: Dielectric: X5R; Voltage: 35V; Voltage Rating: 35V; Halogen Free: Halogen Free; Mount: Surface Mount; Max Operating Temperature: 85°C; Width: 0.02inch; Tolerance: 10%; Min Operating Temperature: -55°C; Length: 1mm; REACH SVHC: No SVHC; Voltage Rating (DC): 35V; Resistor Type: Ceramic; Radiation Hardening: No; Series: M; Termination: SMD/SMT; RoHS Compliant: Yes; Case/Package: 0402; Height: 0.5mm; Packaging: Tape and Reel; Construction: Flat; Capacitance: 100nF; Case Code (Metric): 1005; Case Code (Imperial): 0402; Depth: 0.5mm; Number of Pins: 2; Package Quantity: 1; Thickness: 0.022inch
C24#2 = CMP-14477-004038-2: as C23#1 on sheet DRIVE; Contact Plating: Nickel; Voltage: 35V; Height: 1.25mm; Width: 0.049inch; Voltage Rating: 35V; Depth: 1.25mm; Capacitance: 1uF; Packaging: Tape and Reel; Radiation Hardening: No; Min Operating Temperature: -55°C; Series: M; Halogen Free: Halogen Free; Thickness: 0.053inch; Termination: SMD/SMT; Length: 2mm; Lead Free: Lead Free; Case/Package: 0805; Construction: Flat; RoHS Compliant: Yes; Tolerance: 10%; Package Quantity: 1; Max Operating Temperature: 125°C; Number of Pins: 2; Voltage Rating (DC): 35V; Case Code (Imperial): 0805; Case Code (Metric): 2012; Dielectric: X7R; Mount: Surface Mount
R10 R13 R14 = CMP-2001-04376-1: as R1 on sheet MCU
R11 = CMP-2100-03671-1: as R5#1 on sheet DRIVE; Number of Pins: 2; Number of Terminations: 2; Datasheet URL: http://www.yageo.com/NewPortal/yageodocoutput?fileName=/pdf/R-Chip/PYu-RC_Group_51_RoHS_L_5.pdf; Length: 0.079inch; Package Description: 2-Pin Surface Mounted Device, Body 2 x 1.25 mm; Depth: 1.25mm; Height: 0.024inch; Military Standard: Not; Case/Package: 0805; Package Reference: 0805; RoHSCompliant: true; Lead Free: LeadFree; Packaging: TapeandReel; Package Quantity: 1; Datasheet Version: Rev. 5, 10/2016; Tolerance: 1%; Min Operating Temperature: -55degC; Voltage Rating: 150V; Composition: ThickFilm; Case Code (Imperial): 0805; Power Rating: 125mW; Width: 0.049inch; Case Code (Metric): 2012; Manufacturer URL: http://www.yageo.com/; Max Operating Temperature: 155degC; REACH SVHC: Unknown; Termination: SMD/SMT
R12 = CMP-2003-00017-1: Manufacturer: Panasonic; Part Number: ERJ-8ENF1001V
U2#2 = MT6816CT-ACD: AB=1024线，Z=4LSB，PWM=1KHz; Manufacturer: MagnTek(麦歌恩); Add into BOM: yes; Symbol: MT6816CT-ACD; Device: MT6816CT-ACD; LCSC Part Name: 零延迟磁角位置传感器IC; Supplier Part: C879560; Manufacturer Part: MT6816CT-ACD; Supplier Footprint: SOP-8; JLCPCB Part Class: 扩展库; Datasheet: https://atta.szlcsc.com/upload/public/pdf/source/20201027/C879560_21F27A21E71569DDEA564795613A647F.pdf; Supplier: LCSC; Convert to PCB: yes
U4#2 = CMP-22826-000002-1: SENSOR ANGLE 360DEG SMD; Sensing Method: Hall Effect; Termination: SMD/SMT; Min Operating Temperature: -40°C; Mount: Surface Mount; Lead Free: Lead Free; Max Operating Temperature: 125°C

## Sheet PORT.SchDoc
size A4; SheetNumber: 5; SheetTotal: 5
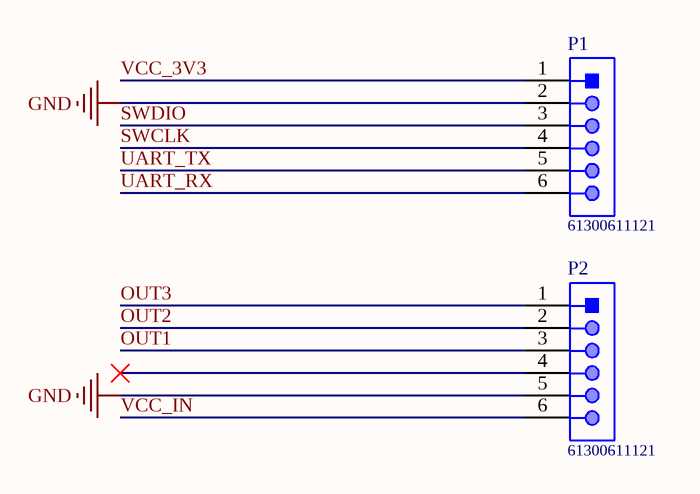
[diagram p4: PORT.SchDoc]

### Parts
P1  61300611121  [61300611121]
P2  61300611121  [61300611121]

### Nets
GND: P1.2 P2.5
VCC_3V3: P1.1
VCC_IN: P2.6
OUT1: P2.3
OUT2: P2.2
OUT3: P2.1
SWCLK: P1.4
SWDIO: P1.3
UART_RX: P1.6
UART_TX: P1.5

Not connected (* = marked no-connect by the designer): P2 4*

### Library data of the parts
P1 P2 = CMP-1502-01070-1: THT Vertical Pin Header WR-PHD, Pitch 2.54 mm, Single Row, 6 pins; Manufacturer: Wurth Elektronik; Gender: Male; Pin Number: 6; Pitch: 2.54mm; Working Voltage: 250VAC; Rated Current: 3A; Withstanding Voltage: 500VAC; Contact Resistance: 20mOhm; Operating Temperature: -40to105degC; Packaging: Bag; Datasheet URL: https://katalog.we-online.de/em/datasheet/6130xx11121.pdf; Package Reference: 61300611121; Mounting Technology: THT; Publisher: WurthElektronik; Part Number: 61300611121; Manufacturer URL: http://www.we-online.de; Row Number: Single; Orientation: Vertical

## Nets that join several sheets
GND: POWER (6 pins), MCU (14 pins), DRIVE (14 pins), SENSOR (6 pins), PORT (P1.2 P2.5)
VCC_3V3: POWER (C7.1 C8.1 U1.3), MCU (10 pins), DRIVE (R6#2.2), SENSOR (6 pins), PORT (P1.1)
VCC_IN: POWER (D1.2), PORT (P2.6)
VM11: POWER (5 pins), DRIVE (6 pins), SENSOR (R10.2)
COMPO: MCU (U2#1.32), DRIVE (R6#2.1 U3#1.19)
EN1: MCU (U2#1.27), DRIVE (R3.1 U3#1.26)
EN2: MCU (U2#1.29), DRIVE (R4.1 U3#1.24)
EN3: MCU (U2#1.31), DRIVE (R5#2.1 U3#1.22)
IN1: MCU (U2#1.26), DRIVE (U3#1.27)
IN2: MCU (U2#1.28), DRIVE (U3#1.25)
IN3: MCU (U2#1.30), DRIVE (U3#1.23)
OUT1: DRIVE (U3#1.5), PORT (P2.3)
OUT2: DRIVE (U3#1.8), PORT (P2.2)
OUT3: DRIVE (U3#1.9), PORT (P2.1)
POWER_U: MCU (U2#1.10), SENSOR (C22#2.1 R10.1 R11.1)
SCL: MCU (U2#1.45), SENSOR (R13.2 U4#2.7)
SDA: MCU (U2#1.46), SENSOR (R14.2 U4#2.6)
SWCLK: MCU (U2#1.37), PORT (P1.4)
SWDIO: MCU (U2#1.34), PORT (P1.3)
UART_RX: MCU (U2#1.43), PORT (P1.6)
UART_TX: MCU (U2#1.42), PORT (P1.5)